# EAGLE schematic tempctl (EAGLE 6.1)
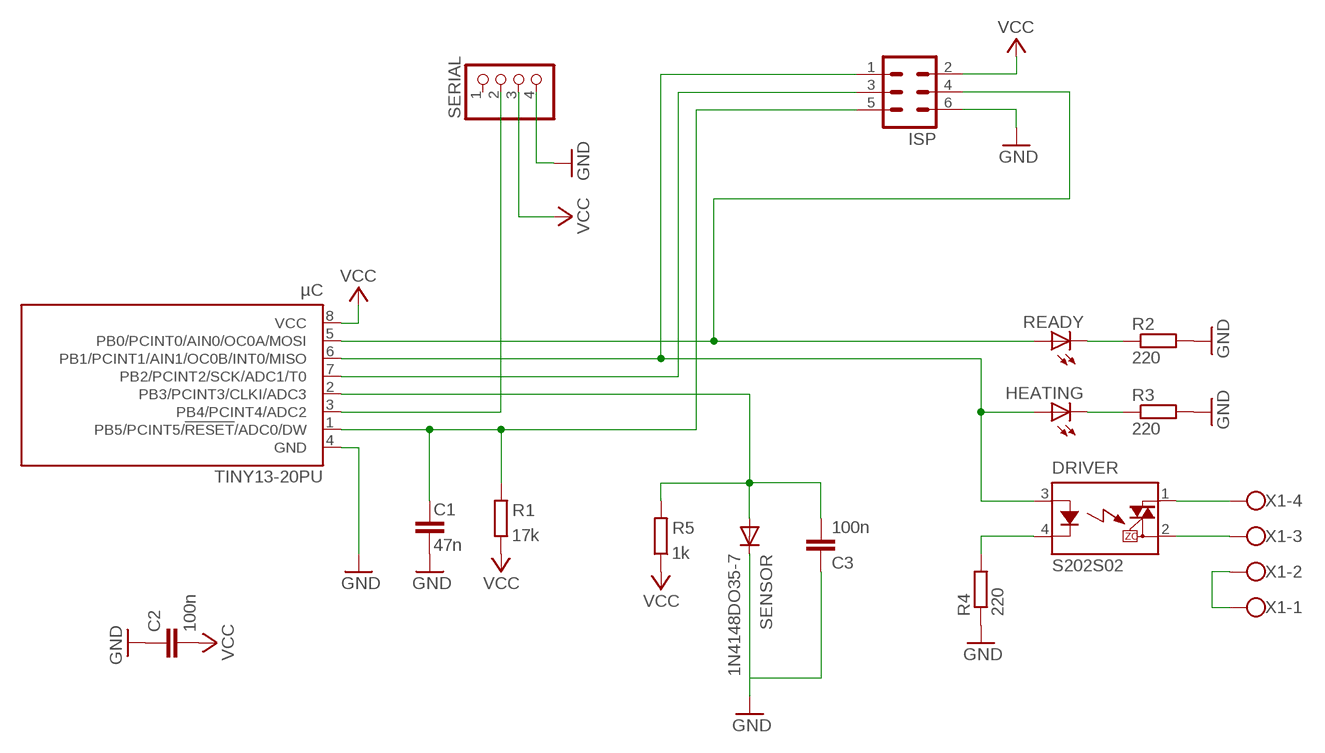
[diagram p0: schematic, sheet 1]

## Parts
C1  47n  C-EU075-032X103  [C075-032X103]
C2  100n  C-EU102-043X133  [C102-043X133]
C3  100n  C-EU102-043X133  [C102-043X133]
DRIVER  S202S02  [S202S02]
HEATING  LED3MM  [LED3MM]
ISP  ML6  [ML6]
R1  17k  R-EU_0207/10  [0207/10]
R2  220  R-EU_0309/12  [0309/12]
R3  220  R-EU_0309/12  [0309/12]
R4  220  R-EU_0309/12  [0309/12]
R5  1k  R-EU_0207/10  [0207/10]
READY  LED3MM  [LED3MM]
SENSOR  1N4148DO35-7  [DO35-7]
SERIAL  PINHD-1X4  [1X04]
X1  W237-4  [W237-4]
µC  TINY13-20PU  [DIL08]

## Nets
GND: C1.2 C2.1 C3.1 ISP.6 R2.2 R3.2 R4.1 SENSOR.C SERIAL.4 µC.4(GND)
MISO/HEATING: DRIVER.3(A) HEATING.A ISP.1 µC.6(PB1/PCINT1/AIN1/OC0B/INT0/MISO)
MOSI/READY: ISP.4 READY.A µC.5(PB0/PCINT0/AIN0/OC0A/MOSI)
N$1: X1.1 X1.2
N$7: R2.1 READY.K(C)
N$8: HEATING.K(C) R3.1
N$9: DRIVER.4(K) R4.2
N$10: DRIVER.1(DS1) X1.4
N$11: DRIVER.2(DS2) X1.3
RESET: C1.1 ISP.5 R1.2 µC.1(PB5/PCINT5/!RESET!/ADC0/DW)
SCK: ISP.3 µC.7(PB2/PCINT2/SCK/ADC1/T0)
SERIAL: SERIAL.2 µC.3(PB4/PCINT4/ADC2)
TEMP: C3.2 R5.2 SENSOR.A µC.2(PB3/PCINT3/CLKI/ADC3)
VCC: C2.2 ISP.2 R1.1 R5.1 SERIAL.3 µC.8(VCC)
Unconnected: SERIAL.1

## Library data of the parts
C1-C3 = rcl:C-EU: CAPACITOR, European symbol
DRIVER = relay:S*02S02: IT(rms) 8A, Zero Cross type SIP 4pin Triac output SSR Source: http://sharp-world.com/products/device/lineup/data/pdf/datasheet/s102s02_e.pdf; MPN: S202S02F; OC_FARNELL: 1618475; OC_NEWARK: 14N9588
HEATING READY = led:LED: LED OSRAM: - CHIPLED LG R971, LG N971, LY N971, LG Q971, LY Q971, LO R971, LY R971 LH N974, LH R974 LS Q976, LO Q976, LY Q976 LO Q996 - Hyper CHIPLED LW Q18S LB Q993, LB Q99A, LB R99A - SideLED LS A670, LO A670, LY A670, LG A670, LP A670 LB A673, LV A673, LT A673, LW A673 LH A674 LY A675 LS A676, LA A676, LO A676, LY A676, LW A676 LS A679, LY A679, LG A679 - Hyper Micro SIDELED® LS Y876, LA Y876, LO Y876, LY Y876 LT Y87S - SmartLED LW L88C, LW L88S LB L89C, LB L89S, LG L890 LS L89K, LO L89K, LY L89K LS L896, LA L896, LO L896, LY L896 - TOPLED LS T670, LO T670, LY T670, LG T670, LP T670 LSG T670, LSP T670, LSY T670, LOP T670, LYG T670 LG T671, LOG T671, LSG T671 LB T673, LV T673, LT T673, LW T673 LH T674 LS T676, LA T676, LO T676, LY T676, LB T676, LH T676, LSB T676, LW T676 LB T67C, LV T67C, LT T67C, LS T67K, LO T67K, LY T67K, LW E67C LS E67B, LA E67B, LO E67B, LY E67B, LB E67C, LV E67C, LT E67C LW T67C LS T679, LY T679, LG T679 LS T770, LO T770, LY T770, LG T770, LP T770 LB T773, LV T773, LT T773, LW T773 LH T774 LS E675, LA E675, LY E675, LS T675 LS T776, LA T776, LO T776, LY T776, LB T776 LHGB T686 LT T68C, LB T68C - Hyper Mini TOPLED® LB M676 - Mini TOPLED Santana® LG M470 LS M47K, LO M47K, LY M47K Source: http://www.osram.convergy.de LUXEON: - LUMILED® LXK2-PW12-R00, LXK2-PW12-S00, LXK2-PW14-U00, LXK2-PW14-V00 LXK2-PM12-R00, LXK2-PM12-S00, LXK2-PM14-U00 LXK2-PE12-Q00, LXK2-PE12-R00, LXK2-PE12-S00, LXK2-PE14-T00, LXK2-PE14-U00 LXK2-PB12-K00, LXK2-PB12-L00, LXK2-PB12-M00, LXK2-PB14-N00, LXK2-PB14-P00, LXK2-PB14-Q00 LXK2-PR12-L00, LXK2-PR12-M00, LXK2-PR14-Q00, LXK2-PR14-R00 LXK2-PD12-Q00, LXK2-PD12-R00, LXK2-PD12-S00 LXK2-PH12-R00, LXK2-PH12-S00 LXK2-PL12-P00, LXK2-PL12-Q00, LXK2-PL12-R00 Source: www.luxeon.com KINGBRIGHT: KA-3528ASYC Source: www.kingbright.com
ISP = con-harting-ml:ML6: HARTING; OC_FARNELL: unknown; OC_NEWARK: unknown
R1-R5 = rcl:R-EU_: RESISTOR, European symbol
SENSOR = diode:1N4148: DIODE high speed (Philips)
SERIAL = pinhead:PINHD-1X4: PIN HEADER
X1 = con-wago-500:W237-4: WAGO SCREW CLAMP; OC_FARNELL: unknown; OC_NEWARK: unknown
µC = atmel:TINY13: 8-bit AVR Microcontroller with 1K Bytes In-System Programmable Flash Source: http://www.atmel.com/dyn/resources/prod_documents/2535S.pdf; MPN: ATTINY13-20PU; OC_FARNELL: 9171550; OC_NEWARK: 96K6521